# EasyEDA schematic 1-Schematic_VCA_TekNoiseLab.json
TITLE: basic VCA (yusynth inspired); REV: 1.0; Date: 2025-03-06; Sheet: 1/1; Drawn By: Tilman; Company: TekNoiseLab
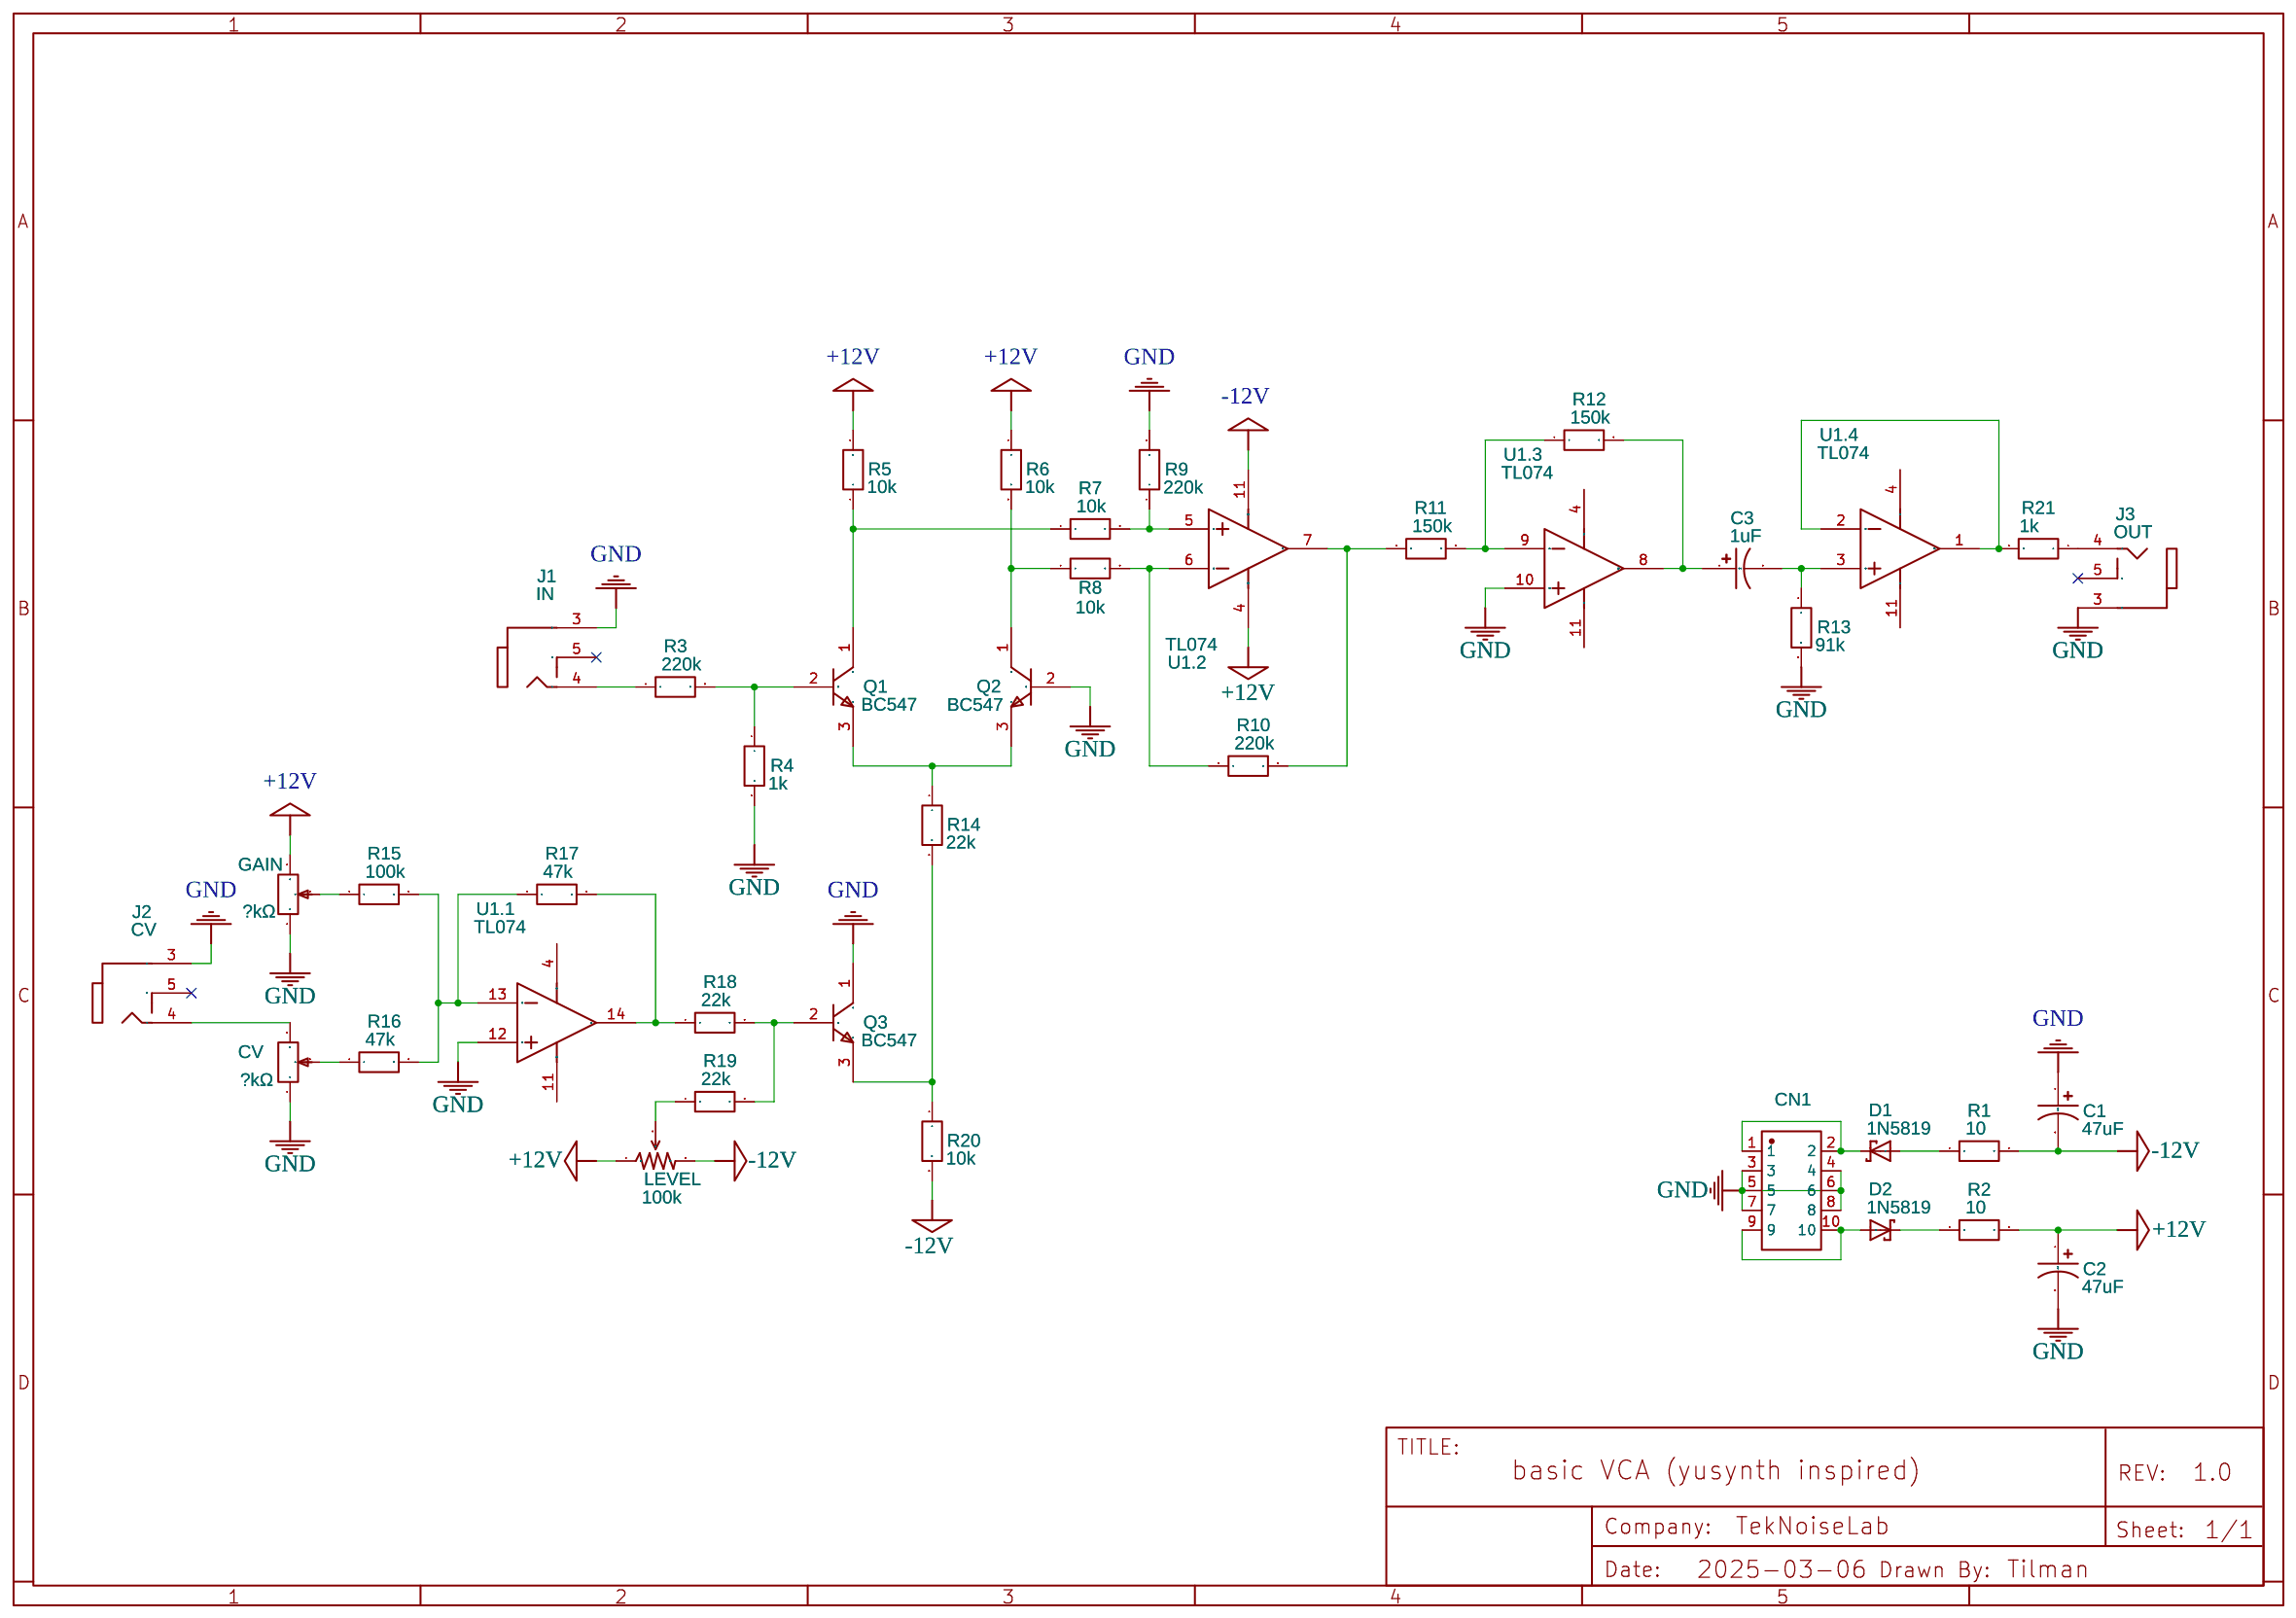
[diagram p0: schematic sheet]

## Parts
C1  47uF  [CAP-TH_BD5.0-P2.00-D0.5-FD]
C2  47uF  [CAP-TH_BD5.0-P2.00-D0.5-FD]
C3  1uF  [CAP-TH_BD5.0-P2.00-D0.5-FD]
CN1  DC3-2.54-10PAS  [CONN-TH_10P-P2.54_DC3-2.54-10PAS]
CV  ?kΩ  [RES-ADJ-TH_RK097111080J]
D1  1N5819  [DO41-7.6]
D2  1N5819  [DO41-7.6]
GAIN  ?kΩ  [RES-ADJ-TH_RK097111080J]
J1  IN  [PJM323 TAYDA A-2557]
J2  CV  [PJM323 TAYDA A-2557]
J3  OUT  [PJM323 TAYDA A-2557]
LEVEL  100k  [TRIM_POT_PTH]
Q1  BC547  [ONSC-TO-92-3-29-11_AM_BL]
Q2  BC547  [ONSC-TO-92-3-29-11_AM_BL]
Q3  BC547  [ONSC-TO-92-3-29-11_AM_BL]
R1  10  [RES-TH_BD2.4-L6.3-P10.30-D0.6]
R2  10  [RES-TH_BD2.4-L6.3-P10.30-D0.6]
R3  220k  [RES-TH_BD2.4-L6.3-P10.30-D0.6]
R4  1k  [RES-TH_BD2.4-L6.3-P10.30-D0.6]
R5  10k  [RES-TH_BD2.4-L6.3-P10.30-D0.6]
R6  10k  [RES-TH_BD2.4-L6.3-P10.30-D0.6]
R7  10k  [RES-TH_BD2.4-L6.3-P10.30-D0.6]
R8  10k  [RES-TH_BD2.4-L6.3-P10.30-D0.6]
R9  220k  [RES-TH_BD2.4-L6.3-P10.30-D0.6]
R10  220k  [RES-TH_BD2.4-L6.3-P10.30-D0.6]
R11  150k  [RES-TH_BD2.4-L6.3-P10.30-D0.6]
R12  150k  [RES-TH_BD2.4-L6.3-P10.30-D0.6]
R13  91k  [RES-TH_BD2.4-L6.3-P10.30-D0.6]
R14  22k  [RES-TH_BD2.4-L6.3-P10.30-D0.6]
R15  100k  [RES-TH_BD2.4-L6.3-P10.30-D0.6]
R16  47k  [RES-TH_BD2.4-L6.3-P10.30-D0.6]
R17  47k  [RES-TH_BD2.4-L6.3-P10.30-D0.6]
R18  22k  [RES-TH_BD2.4-L6.3-P10.30-D0.6]
R19  22k  [RES-TH_BD2.4-L6.3-P10.30-D0.6]
R20  10k  [RES-TH_BD2.4-L6.3-P10.30-D0.6]
R21  1k  [RES-TH_BD2.4-L6.3-P10.30-D0.6]
U1  TL074  [DIP14]  (sections 1,2,3,4)

## Library data of the parts
C1-C3 = 50MS710MEFCTZ5X7: Contributor: lcsc; Supplier: LCSC; Supplier Part: C5115261; Manufacturer: rubycon(红宝石)
CN1 = DC3-2.54-10PAS: Contributor: lcsc; Supplier: LCSC; Supplier Part: C2977596; Manufacturer: ZHOURI(洲日); JLCPCB Part Class: Extended Part
CV GAIN = RK097111080J: Resistance(Ohms): 10K; Supplier: LCSC; Manufacturer: ALPSALPINE(阿尔卑斯阿尔派); Supplier Part: C97444; JLCPCB Part Class: Extended Part
D1 D2 = 1N5819-B: 1.0A SCHOTTKY BARRIER RECTIFIER
J1-J3 = PJ323M Tayda: Supplier: Tayda; Supplier Part: A-2557; Contributor: flounderguts
LEVEL = TRIMPOT: Contributor: SparkFun
Q1-Q3 = BC547BRL1G: Amplifier Transistor, NPN Silicon, 3-Pin TO-92, Pb-Free, Tape and Reel
R1-R21 = Res_AXIAL-0.4(1/4W)_US
U1 = TL074BCN: Low-Noise JFET-Input Operational Amplifier, 7 to 36 V, 0 to 70 degC, 14-pin DIP (N14), Pb-Free (RoHS); subpart_no: 1

## Nets
+12V: C2.1 GAIN.3 LEVEL.1(CCW) R2.2 R5.2 R6.1 U1.4(VCC+)
-12V: C1.2 LEVEL.3(CW) R1.2 R20.2 U1.11(VCC-)
GND: C1.1 C2.2 CN1.3 CN1.4 CN1.5 CN1.6 CN1.7 CN1.8 CV.1 GAIN.1 J1.3 J2.3 J3.3 Q2.2(B) Q3.1(C) R4.2 R9.2 R13.2 U1.10(IN3+) U1.12(IN4+)
Net-(C3-1): C3.1 R12.2 U1.8(OUT3)
Net-(C3-2): C3.2 R13.1 U1.3(IN1+)
Net-(CN1-1): CN1.1 CN1.2 D1.C
Net-(CN1-9): CN1.9 CN1.10 D2.A
Net-(CV-2): CV.2 R16.1
Net-(CV-3): CV.3 J2.4
Net-(D1-A): D1.A R1.1
Net-(D2-C): D2.C R2.1
Net-(GAIN-2): GAIN.2 R15.1
Net-(J1-4): J1.4 R3.1
Net-(J3-4): J3.4 R21.1
Net-(LEVEL-2): LEVEL.2(WIPER) R19.1
Net-(Q1-1): Q1.1(C) R5.1 R7.1
Net-(Q1-2): Q1.2(B) R3.2 R4.1
Net-(Q1-3): Q1.3(E) Q2.3(E) R14.1
Net-(Q2-1): Q2.1(C) R6.2 R8.1
Net-(Q3-2): Q3.2(B) R18.2 R19.2
Net-(Q3-3): Q3.3(E) R14.2 R20.1
Net-(R7-2): R7.2 R9.1 U1.5(IN2+)
Net-(R8-2): R8.2 R10.1 U1.6(IN2-)
Net-(R10-2): R10.2 R11.1 U1.7(OUT2)
Net-(R11-2): R11.2 R12.1 U1.9(IN3-)
Net-(R15-2): R15.2 R16.2 R17.1 U1.13(IN4-)
Net-(R17-2): R17.2 R18.1 U1.14(OUT4)
Net-(R21-2): R21.2 U1.1(OUT1) U1.2(IN1-)

Not connected (* = marked no-connect by the designer): J1 5*; J2 5*; J3 5*
